# EAGLE design LifeBoardV1.2 (EAGLE 9.6.2)
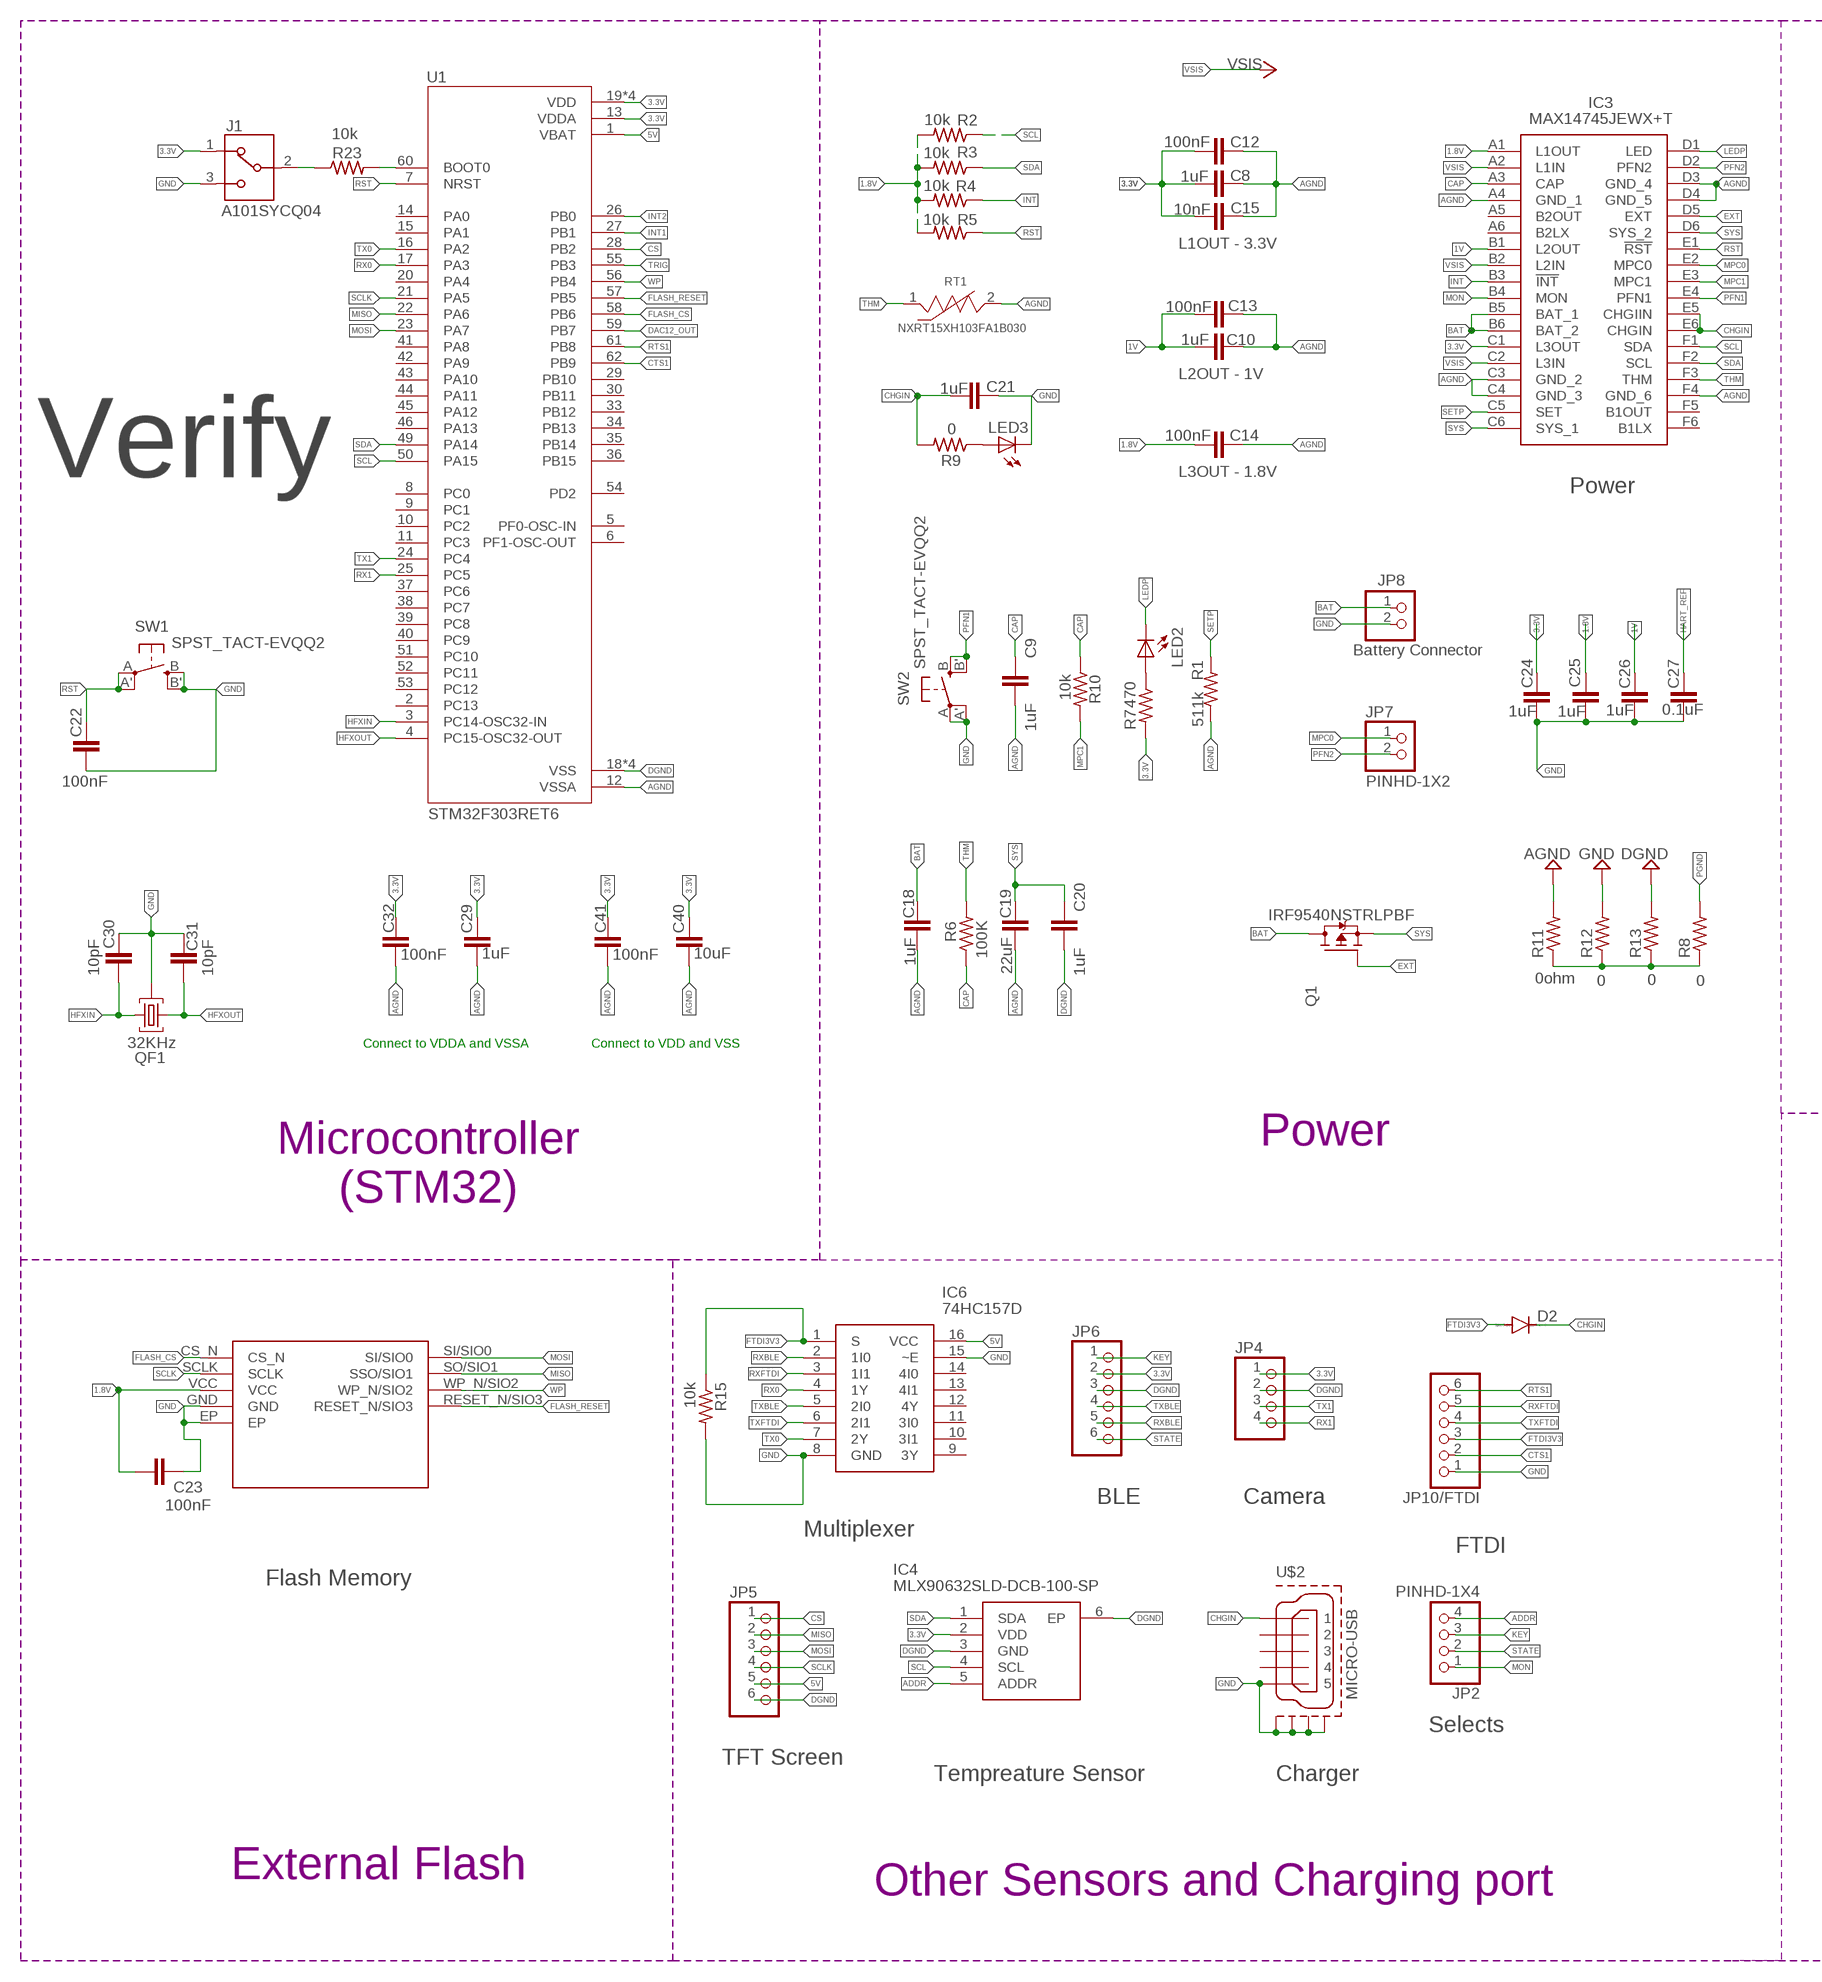
[diagram p0: schematic, sheet 1, part 1 of 2]
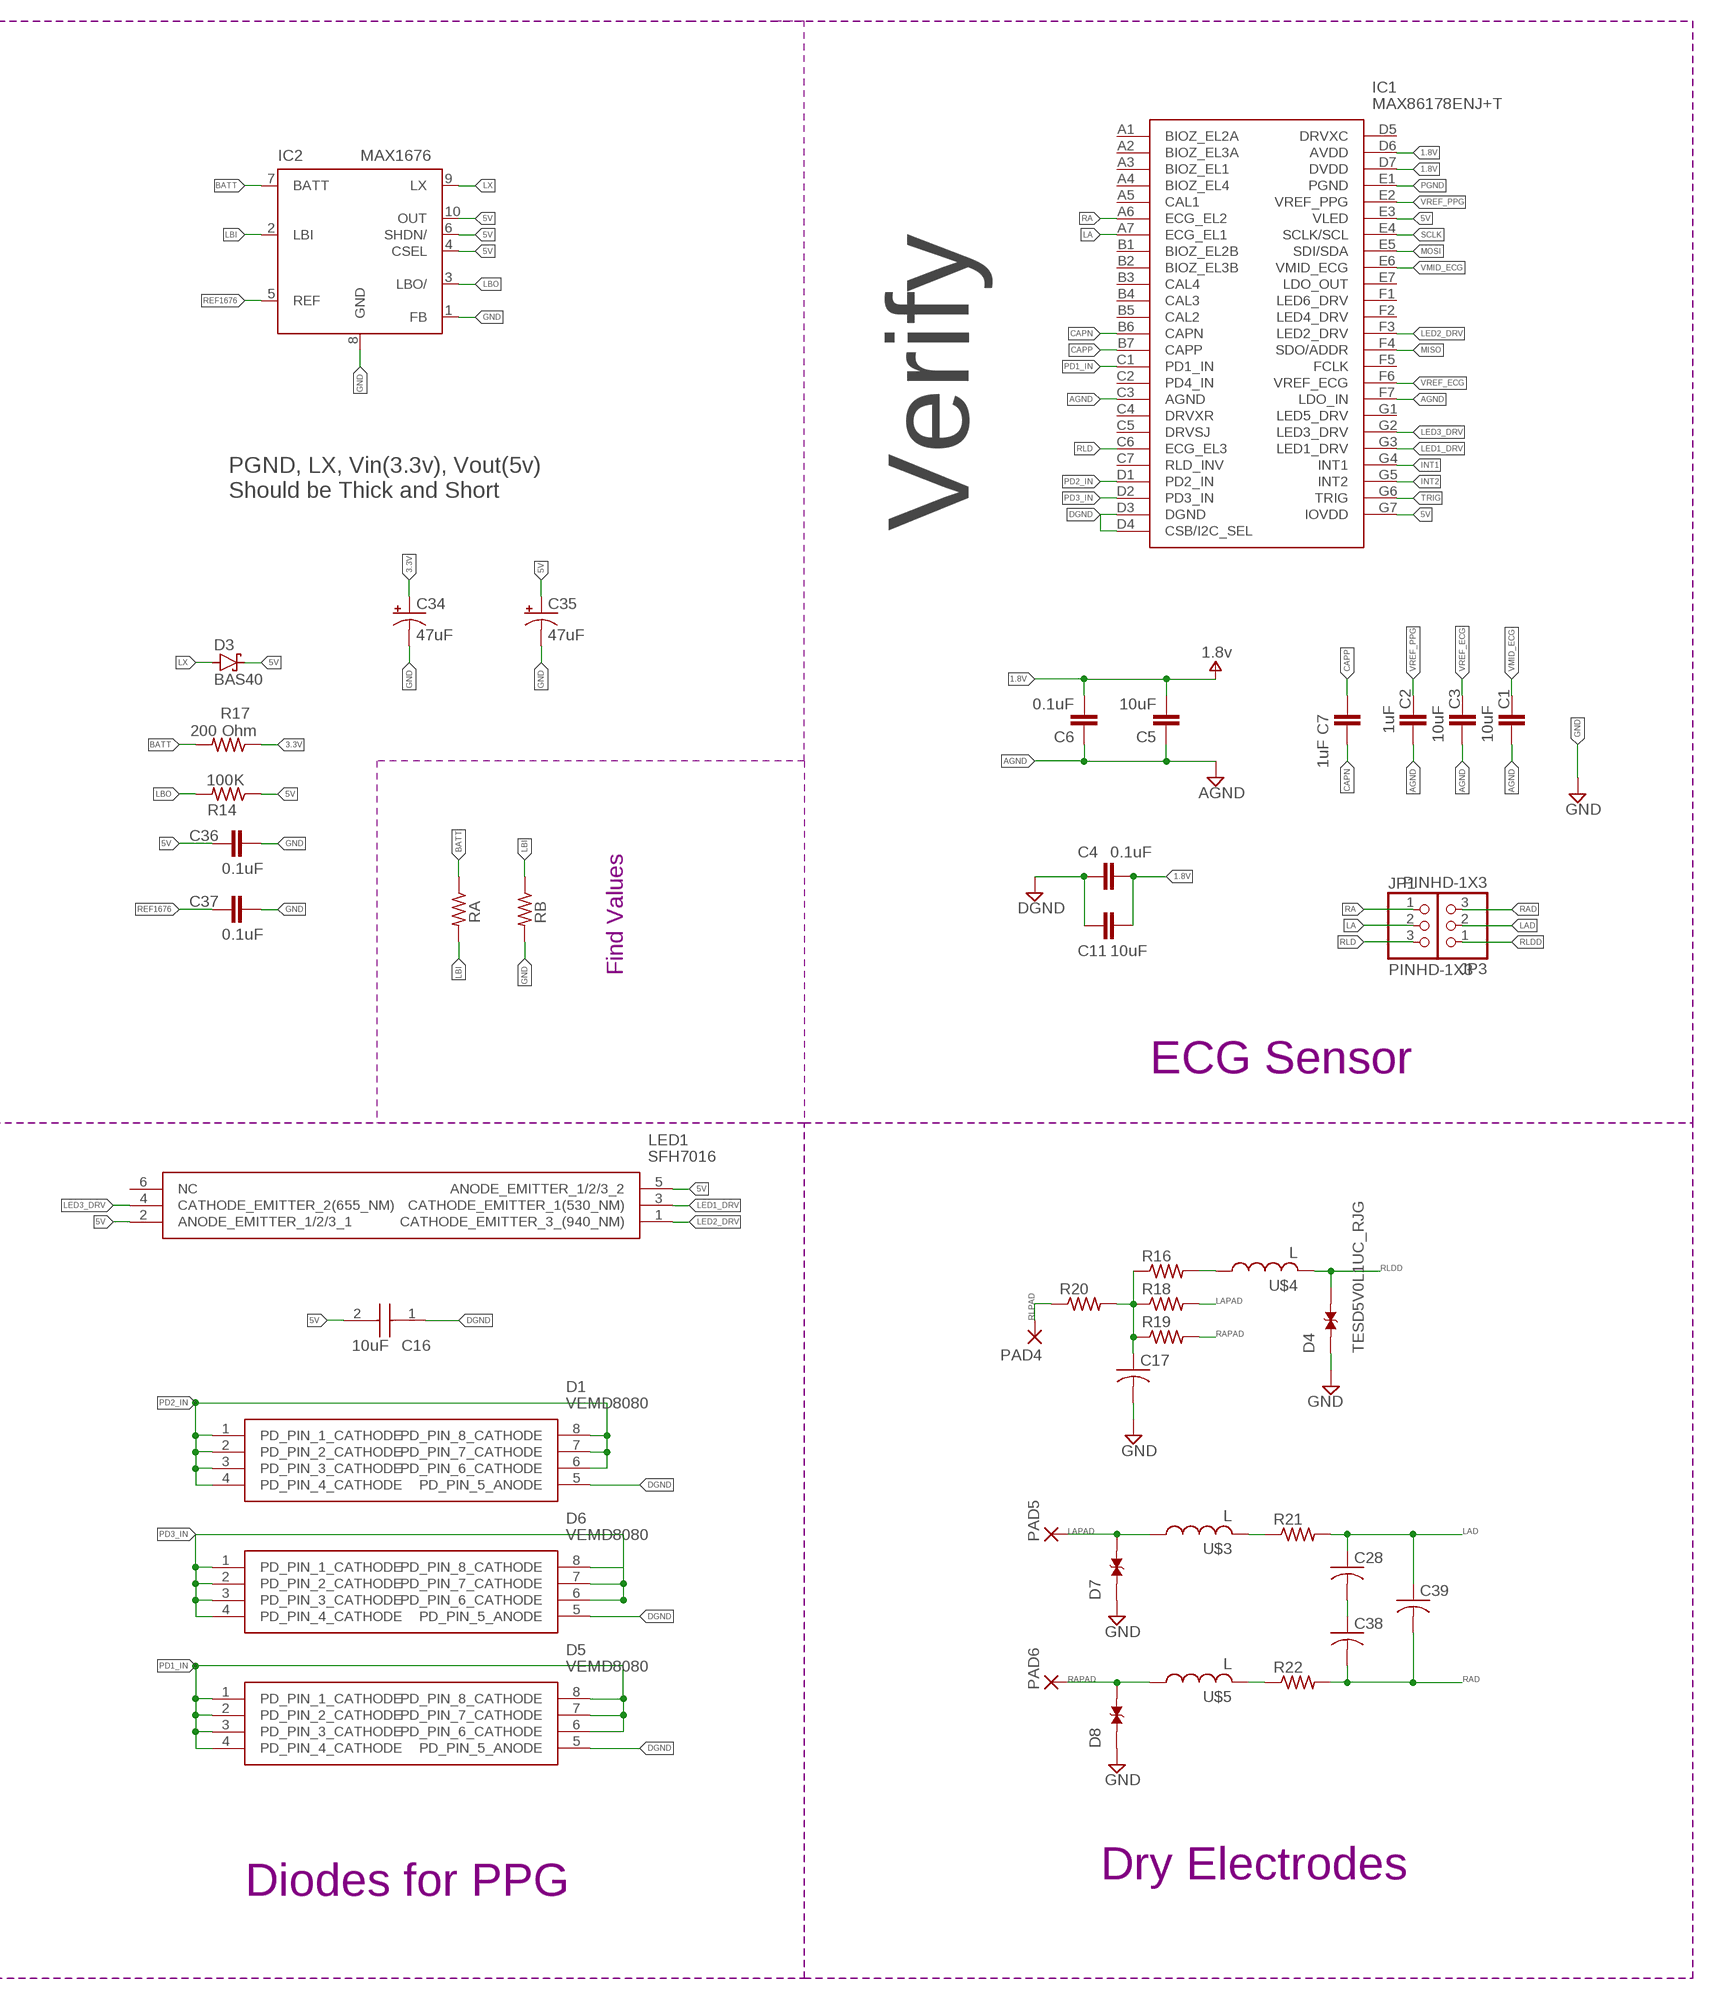
[diagram p1: schematic, sheet 1, part 2 of 2]

## Parts
C1  10uF  C-EUC0805  [C0805]
C2  1uF  C-EUC0805  [C0805]
C3  10uF  C-EUC0805  [C0805]
C4  0.1uF  C-EUC0805  [C0805]
C5  10uF  C-EUC0805  [C0805]
C6  0.1uF  C-EUC0805  [C0805]
C7  1uF  C-EUC0805  [C0805]
C8  1uF  C-EUC0805  [C0805]
C9  1uF  C-EUC0805  [C0805]
C10  1uF  C-EUC0805  [C0805]
C11  10uF  C-EUC0805  [C0805]
C12  100nF  C-EUC0805  [C0805]
C13  100nF  C-EUC0805  [C0805]
C14  100nF  C-EUC0805  [C0805]
C15  10nF  C-EUC0805  [C0805]
C16  10uF  GRM188R61E106MA73L  [CAPC1608X90N]
C17  C-US025-024X044  [C025-024X044]
C18  1uF  C-EUC0805  [C0805]
C19  22uF  C-EUC0805  [C0805]
C20  1uF  C-EUC0805  [C0805]
C21  1uF  C-EUC0805  [C0805]
C22  100nF  C-EUC0805  [C0805]
C23  100nF  C-EUC0805  [C0805]
C24  1uF  C-EUC0805  [C0805]
C25  1uF  C-EUC0805  [C0805]
C26  1uF  C-EUC0805  [C0805]
C27  0.1uF  C-EUC0805  [C0805]
C28  C-US025-024X044  [C025-024X044]
C29  1uF  C-EUC0805  [C0805]
C30  10pF  C-EUC0805  [C0805]
C31  10pF  C-EUC0805  [C0805]
C32  100nF  C-EUC0805  [C0805]
C34  47uF  CPOL-US153CLV-0405  [153CLV-0405]
C35  47uF  CPOL-US153CLV-0405  [153CLV-0405]
C36  0.1uF  C-EUC0805  [C0805]
C37  0.1uF  C-EUC0805  [C0805]
C38  C-US025-024X044  [C025-024X044]
C39  C-US025-024X044  [C025-024X044]
C40  10uF  C-EUC0805  [C0805]
C41  100nF  C-EUC0805  [C0805]
D1  VEMD8080  [VEMD8080]
D2  CGRM4001-G  [SOD-123_MINI-SMA]
D3  BAS40  [SOT23]
D4  TESD5V0L1UC_RJG  [DIO_TESD5V0L1UC_RJG]
D5  VEMD8080  [VEMD8080]
D6  VEMD8080  [VEMD8080]
D7  TESD5V0L1UC_RJG  [DIO_TESD5V0L1UC_RJG]
D8  TESD5V0L1UC_RJG  [DIO_TESD5V0L1UC_RJG]
IC1  MAX86178ENJ+T  [BGA49C35P7X7_277X257X50]
IC2  MAX1676  [UMAX10]
IC3  MAX14745JEWX+T  [BGA36C40P6X6_269X244X69]
IC4  MLX90632SLD-DCB-100-SP  [MLX90632SLDDCB100SP]
IC6  74HC157D  [SOIC127P600X175-16N]
J1  A101SYCQ04  [TE_A101SYCQ04]
JP1  PINHD-1X3  [1X03]
JP2  PINHD-1X4  [1X04]
JP3  PINHD-1X3  [1X03]
JP4  PINHD-1X4  [1X04]
JP5  PINHD-1X6  [1X06]
JP6  PINHD-1X6  [1X06]
JP7  PINHD-1X2  [1X02]
JP8  Battery Connector  PINHD-1X2  [1X02]
JP10/FTDI  PINHD-1X6  [1X06]
LED1  SFH7016  [SFH7016]
LED2  LEDCHIPLED_1206  [CHIPLED_1206]
LED3  LEDCHIPLED_1206  [CHIPLED_1206]
PAD4  SMD5  [SMD2,54-5,08]
PAD5  SMD5  [SMD2,54-5,08]
PAD6  SMD5  [SMD2,54-5,08]
Q1  IRF9540NSTRLPBF  [DPAK254P1524X483-4_3N]
QF1  32KHz  8M10AHC49T  [HC49U]
R1  511k  R-US_M1206  [M1206]
R2  10k  R-US_M1206  [M1206]
R3  10k  R-US_M1206  [M1206]
R4  10k  R-US_M1206  [M1206]
R5  10k  R-US_M1206  [M1206]
R6  100K  R-US_M1206  [M1206]
R7  470  R-US_M1206  [M1206]
R8  0  R-US_R1206  [R1206]
R9  0  R-US_R1206  [R1206]
R10  10k  R-US_M1206  [M1206]
R11  0ohm  R-US_R1206  [R1206]
R12  0  R-US_R1206  [R1206]
R13  0  R-US_R1206  [R1206]
R14  100K  R-US_R1206  [R1206]
R15  10k  R-US_M1206  [M1206]
R16  R-US_0207/10  [0207/10]
R17  200 Ohm  R-US_R1206  [R1206]
R18  R-US_0207/10  [0207/10]
R19  R-US_0207/10  [0207/10]
R20  R-US_0207/10  [0207/10]
R21  R-US_0207/10  [0207/10]
R22  R-US_0207/10  [0207/10]
R23  10k  R-US_M1206  [M1206]
RA  R-US_R1206  [R1206]
RB  R-US_R1206  [R1206]
RT1  NXRT15XH103FA1B030  [THERM_NXRT15XH103FA1B030]
SW1  SPST_TACT-EVQQ2  [EVQ-Q2]
SW2  SPST_TACT-EVQQ2  [EVQ-Q2]
U1  STM32F303RET6  [QFP50P1200X1200X160-64N]
U$1  FLASH  [SON127P600X800X80-9N]
U$2  MICRO-USB  MICRO-USB-RECEPTACLE47589-0001  [47589-0001]
U$3  L  [6000]
U$4  L  [6000]
U$5  L  [6000]

## Nets
1.8V: C4.2 C5.2 C6.2 C11.2 C14.2 C23.1 C25.1 IC1.D6(AVDD) IC1.D7(DVDD) IC3.A1(L1OUT) R2.2 R3.2 R4.2 R5.2 U$1.VCC ; supply symbol labelled 1.8v
1V: C10.2 C13.2 C26.1 IC3.B1(L2OUT)
3.3V: C8.2 C12.2 C15.2 C24.1 C29.1 C32.1 C34.+ C40.1 C41.1 IC3.C1(L3OUT) IC4.2(VDD) J1.1 JP4.1 JP6.2 R7.2 R17.1 U1.13(VDDA) U1.19(VDD) U1.32(VDD) U1.48(VDD) U1.64(VDD)
5V: C16.2 C35.+ C36.1 D3.3(C) IC1.E3(VLED) IC1.G7(IOVDD) IC2.4(CSEL) IC2.6(SHDN/) IC2.10(OUT) IC6.16(VCC) JP5.5 LED1.2(ANODE_EMITTER_1/2/3_1) LED1.5(ANODE_EMITTER_1/2/3_2) R14.1 U1.1(VBAT)
ADDR: IC4.5(ADDR) JP2.4
AGND: C1.1 C2.1 C3.1 C5.1 C6.1 C8.1 C9.2 C10.1 C12.1 C13.1 C14.1 C15.1 C18.2 C19.2 C29.2 C32.2 C40.2 C41.2 IC1.C3(AGND) IC1.F7(LDO_IN) IC3.A4(GND_1) IC3.C3(GND_2) IC3.C4(GND_3) IC3.D3(GND_4) IC3.D4(GND_5) IC3.F4(GND_6) R1.1 R11.2 RT1.2 U1.12(VSSA)
BAT: C18.1 IC3.B5(BAT_1) IC3.B6(BAT_2) JP8.1 Q1.4(D)
BATT: IC2.7(BATT) R17.2 RA.1
CAP: C9.1 IC3.A3(CAP) R6.1 R10.1
CAPN: C7.2 IC1.B6(CAPN)
CAPP: C7.1 IC1.B7(CAPP)
CHGIN: C21.2 D2.C IC3.E5(CHGIIN) IC3.E6(CHGIN) R9.2 U$2.1
CS: JP5.1 U1.28(PB2)
CTS1: JP10/FTDI.2 U1.62(PB9)
DAC12_OUT: U1.59(PB7)
DGND: C4.1 C11.1 C16.1 C20.2 D1.5(PD_PIN_5_ANODE) D5.5(PD_PIN_5_ANODE) D6.5(PD_PIN_5_ANODE) IC1.D3(DGND) IC1.D4(CSB/I2C_SEL) IC4.3(GND) IC4.6(EP) JP4.2 JP5.6 JP6.3 R13.2 U1.18(VSS) U1.31(VSS) U1.47(VSS) U1.63(VSS)
EXT: IC3.D5(EXT) Q1.1(G)
FLASH_CS: U1.58(PB6) U$1.CS_N
FLASH_RESET: U1.57(PB5) U$1.RESET_N/SIO3
FTDI3V3: D2.A IC6.1(S) JP10/FTDI.3 R15.1
GND: C17.2 C21.1 C22.2 C23.2 C24.2 C25.2 C26.2 C27.2 C30.1 C31.1 C34.- C35.- C36.2 C37.2 D4.1 D7.1 D8.1 IC2.1(FB) IC2.8(GND) IC6.8(GND) IC6.15(~E) J1.3 JP8.2 JP10/FTDI.1 LED3.C QF1.2 R12.2 R15.2 RB.2 SW1.B'(S1) SW1.B(S) SW2.A'(P1) SW2.A(P) U$1.EP U$1.GND U$2.5 U$2.CASING1(GND1) U$2.CASING2(GND2) U$2.CASING3(GND3) U$2.CASING4(GND4)
HART_REF: C27.1
HFXIN: C30.2 QF1.3 U1.3(PC14-OSC32-IN)
HFXOUT: C31.2 QF1.1 U1.4(PC15-OSC32-OUT)
INT: IC3.B3(!INT) R4.1
INT1: IC1.G4(INT1) U1.27(PB1)
INT2: IC1.G5(INT2) U1.26(PB0)
KEY: JP2.3 JP6.1
LA: IC1.A7(ECG_EL1) JP1.2
LAD: C28.1 C39.1 JP3.2 R21.2
LAPAD: D7.2 PAD5.1(P) R18.2 U$3.1
LBI: IC2.2(LBI) RA.2 RB.1
LBO: IC2.3(LBO/) R14.2
LED1_DRV: IC1.G3(LED1_DRV) LED1.3(CATHODE_EMITTER_1(530_NM))
LED2_DRV: IC1.F3(LED2_DRV) LED1.1(CATHODE_EMITTER_3_(940_NM))
LED3_DRV: IC1.G2(LED3_DRV) LED1.4(CATHODE_EMITTER_2(655_NM))
LEDP: IC3.D1(LED) LED2.C
LX: D3.1(A) IC2.9(LX)
MISO: IC1.F4(SDO/ADDR) JP5.2 U1.22(PA6) U$1.SO/SIO1(SSO/SIO1)
MON: IC3.B4(MON) JP2.1
MOSI: IC1.E5(SDI/SDA) JP5.3 U1.23(PA7) U$1.SI/SIO0
MPC0: IC3.E2(MPC0) JP7.1
MPC1: IC3.E3(MPC1) R10.2
N$1: LED2.A R7.1
N$2: C17.1 R16.1 R18.1 R19.1 R20.2
N$3: R16.2 U$4.1
N$4: R23.2 U1.60(BOOT0)
N$5: J1.2 R23.1
N$8: R21.1 U$3.2
N$10: C28.2 C38.1
N$12: R22.1 U$5.2
N$28: R8.1 R11.1 R12.1 R13.1
N$29: LED3.A R9.1
PD1_IN: D5.1(PD_PIN_1_CATHODE) D5.2(PD_PIN_2_CATHODE) D5.3(PD_PIN_3_CATHODE) D5.4(PD_PIN_4_CATHODE) D5.6(PD_PIN_6_CATHODE) D5.7(PD_PIN_7_CATHODE) D5.8(PD_PIN_8_CATHODE) IC1.C1(PD1_IN)
PD2_IN: D1.1(PD_PIN_1_CATHODE) D1.2(PD_PIN_2_CATHODE) D1.3(PD_PIN_3_CATHODE) D1.4(PD_PIN_4_CATHODE) D1.6(PD_PIN_6_CATHODE) D1.7(PD_PIN_7_CATHODE) D1.8(PD_PIN_8_CATHODE) IC1.D1(PD2_IN)
PD3_IN: D6.1(PD_PIN_1_CATHODE) D6.2(PD_PIN_2_CATHODE) D6.3(PD_PIN_3_CATHODE) D6.4(PD_PIN_4_CATHODE) D6.6(PD_PIN_6_CATHODE) D6.7(PD_PIN_7_CATHODE) D6.8(PD_PIN_8_CATHODE) IC1.D2(PD3_IN)
PFN1: IC3.E4(PFN1) SW2.B'(S1) SW2.B(S)
PFN2: IC3.D2(PFN2) JP7.2
PGND: IC1.E1(PGND) R8.2
RA: IC1.A6(ECG_EL2) JP1.1
RAD: C38.2 C39.2 JP3.3 R22.2
RAPAD: D8.2 PAD6.1(P) R19.2 U$5.1
REF1676: C37.1 IC2.5(REF)
RLD: IC1.C6(ECG_EL3) JP1.3
RLDD: D4.2 JP3.1 U$4.2
RLPAD: PAD4.1(P) R20.1
RST: C22.1 IC3.E1(!RST) R5.1 SW1.A'(P1) SW1.A(P) U1.7(NRST)
RTS1: JP10/FTDI.6 U1.61(PB8)
RX0: IC6.4(1Y) U1.17(PA3)
RX1: JP4.4 U1.25(PC5)
RXBLE: IC6.2(1I0) JP6.5
RXFTDI: IC6.3(1I1) JP10/FTDI.5
SCL: IC3.F1(SDA) IC4.4(SCL) R2.1 U1.50(PA15)
SCLK: IC1.E4(SCLK/SCL) JP5.4 U1.21(PA5) U$1.SCLK
SDA: IC3.F2(SCL) IC4.1(SDA) R3.1 U1.49(PA14)
SETP: IC3.C5(SET) R1.2
STATE: JP2.2 JP6.6
SYS: C19.1 C20.1 IC3.C6(SYS_1) IC3.D6(SYS_2) Q1.3(S)
THM: IC3.F3(THM) R6.2 RT1.1
TRIG: IC1.G6(TRIG) U1.55(PB3)
TX0: IC6.7(2Y) U1.16(PA2)
TX1: JP4.3 U1.24(PC4)
TXBLE: IC6.5(2I0) JP6.4
TXFTDI: IC6.6(2I1) JP10/FTDI.4
VMID_ECG: C1.2 IC1.E6(VMID_ECG)
VREF_ECG: C3.2 IC1.F6(VREF_ECG)
VREF_PPG: C2.2 IC1.E2(VREF_PPG)
VSIS: IC3.A2(L1IN) IC3.B2(L2IN) IC3.C2(L3IN)
WP: U1.56(PB4) U$1.WP_N/SIO2
Unconnected: IC1.A1(BIOZ_EL2A) IC1.A2(BIOZ_EL3A) IC1.A3(BIOZ_EL1) IC1.A4(BIOZ_EL4) IC1.A5(CAL1) IC1.B1(BIOZ_EL2B) IC1.B2(BIOZ_EL3B) IC1.B3(CAL4) IC1.B4(CAL3) IC1.B5(CAL2) IC1.C2(PD4_IN) IC1.C4(DRVXR) IC1.C5(DRVSJ) IC1.C7(RLD_INV) IC1.D5(DRVXC) IC1.E7(LDO_OUT) IC1.F1(LED6_DRV) IC1.F2(LED4_DRV) IC1.F5(FCLK) IC1.G1(LED5_DRV) IC3.A5(B2OUT) IC3.A6(B2LX) IC3.F5(B1OUT) IC3.F6(B1LX) IC6.9(3Y) IC6.10(3I1) IC6.11(3I0) IC6.12(4Y) IC6.13(4I1) IC6.14(4I0) LED1.6(NC) U1.2(PC13) U1.5(PF0-OSC-IN) U1.6(PF1-OSC-OUT) U1.8(PC0) U1.9(PC1) U1.10(PC2) U1.11(PC3) U1.14(PA0) U1.15(PA1) U1.20(PA4) U1.29(PB10) U1.30(PB11) U1.33(PB12) U1.34(PB13) U1.35(PB14) U1.36(PB15) U1.37(PC6) U1.38(PC7) U1.39(PC8) U1.40(PC9) U1.41(PA8) U1.42(PA9) U1.43(PA10) U1.44(PA11) U1.45(PA12) U1.46(PA13) U1.51(PC10) U1.52(PC11) U1.53(PC12) U1.54(PD2) U$2.2 U$2.3 U$2.4

## Notes on the sheet
- L1OUT - 3.3V
- L2OUT - 1V
- Verify | L3OUT - 1.8V
- Power
- PGND, LX, Vin(3.3v), Vout(5v)
  Should be Thick and Short
- Verify
- Find Values
- Connect to VDDA and VSSA | Connect to VDD and VSS
- ECG Sensor
- Power
- Microcontroller
  (STM32)
- BLE | Camera
- Multiplexer
- FTDI
- Flash Memory
- Selects
- TFT Screen
- Tempreature Sensor | Charger
- External Flash
- Other Sensors and Charging port | Dry Electrodes
- Diodes for PPG

## Library data of the parts
C1-C15 C18-C27 C29-C32 C36 C37 C40 C41 = rcl:C-EU: CAPACITOR, European symbol; SPICEPREFIX: C
C16 = GRM188R61E106MA73L:GRM188R61E106MA73L: Murata 0603 GRM 10uF Ceramic Multilayer Capacitor, 25 V dc, +85C, X5R Dielectric, +/-20% SMD Source: Datasheet <https://datasheet.datasheetarchive.com/originals/distributors/DKDS42/DSANUWW0047682.pdf>; ARROW_PART_NUMBER: GRM188R61E106MA73L; ARROW_PRICE-STOCK: https://www.arrow.com/en/products/grm188r61e106ma73l/murata-manufacturing; DESCRIPTION: Murata 0603 GRM 10uF Ceramic Multilayer Capacitor, 25 V dc, +85C, X5R Dielectric, +/-20% SMD; HEIGHT: 0.9mm; MANUFACTURER_NAME: Murata Electronics; MANUFACTURER_PART_NUMBER: GRM188R61E106MA73L; MOUSER_PART_NUMBER: 81-GRM188R61E106MA3L; MOUSER_PRICE-STOCK: https://www.mouser.co.uk/ProductDetail/Murata-Electronics/GRM188R61E106MA73L?qs=O5cugoO6nwfz85kEL7somA%3D%3D
C17 C28 C38 C39 = adafruit:C-US: CAPACITOR, American symbol
C34 C35 = adafruit:CPOL-US: POLARIZED CAPACITOR, American symbol
D1 D5 D6 = VEMD8080:VEMD8080: Photodiodes Pin Photodiode 20V 350-1100nm; 28uA Source: Datasheet <https://www.vishay.com/docs/84565/vemd8080.pdf>; ARROW_PART_NUMBER: VEMD8080; ARROW_PRICE-STOCK: https://www.arrow.com/en/products/vemd8080/vishay?region=nac; DESCRIPTION: Photodiodes Pin Photodiode 20V 350-1100nm; 28uA; HEIGHT: 0.53mm; MANUFACTURER_NAME: Vishay; MANUFACTURER_PART_NUMBER: VEMD8080; MOUSER_PART_NUMBER: 78-VEMD8080; MOUSER_PRICE-STOCK: https://www.mouser.co.uk/ProductDetail/Vishay-Semiconductors/VEMD8080?qs=F5EMLAvA7IBCchs2bw9l%2Fw%3D%3D
D2 = diode:CGRM400*-G: Molded plasitc,JEDEC SOD-123/Mini SMA Source: Comchip CGRM4001-G.pdf
D3 = diode:BAS40: Silicon Schottky Diodes General-purpose diode for high-speed switching
D4 D7 D8 = TESD5V0L1UC_RJG:TESD5V0L1UC_RJG: Check availability <https://pricing.snapeda.com/parts/TESD5V0L1UC%20RJG/Taiwan%20Semiconductor%20Corporation/view-part?ref=eda>; AVAILABILITY: In Stock; DESCRIPTION: DFN1006L, 5V, 100W, 2pF, ESD Protection Diode & Array; MF: Taiwan Semiconductor Corporation; MP: TESD5V0L1UC RJG; PACKAGE: DFN1006L Taiwan Semiconductor; PRICE: None; PURCHASE-URL: https://pricing.snapeda.com/search/part/TESD5V0L1UC RJG/?ref=eda
IC1 = MAX86178ENJ+T:MAX86178ENJ+T: Ultra-Low-Power, Clinical-Grade Vital-Sign AFE Source: Datasheet <https://g.componentsearchengine.com/Datasheets/0/15123196.pdf>; DESCRIPTION: Ultra-Low-Power, Clinical-Grade Vital-Sign AFE; HEIGHT: 0.5mm; MANUFACTURER_NAME: Maxim Integrated; MANUFACTURER_PART_NUMBER: MAX86178ENJ+T; MOUSER_PART_NUMBER: 700-MAX86178ENJ+T; MOUSER_PRICE-STOCK: https://www.mouser.co.uk/ProductDetail/Maxim-Integrated/MAX86178ENJ%2bT?qs=A6eO%252BMLsxmSS411w8Lj65w%3D%3D
IC2 = MAX1676:MAX1676: DC/DC CONVERTER Check availability <https://pricing.snapeda.com/parts/MAX1676/Maxim%20Integrated/view-part?ref=eda>; AVAILABILITY: In Stock; DESCRIPTION: Boost Switching Regulator IC Positive Adjustable (Programmable) 2V (3.3V, 5V) 1 Output 360mA (Switch), 750mA (Switch) 10-TFSOP, 10-MSOP (0.118, 3.00mm Width); MF: Maxim Integrated; MP: MAX1676; PACKAGE: None; PRICE: None; PURCHASE-URL: https://pricing.snapeda.com/search/part/MAX1676/?ref=eda
IC3 = MAX14745JEWX+T:MAX14745JEWX+T: Battery Management Wearable Charge Management Solution Source: Datasheet <https://pdfserv.maximintegrated.com/en/ds/MAX14745.pdf>; DESCRIPTION: Battery Management Wearable Charge Management Solution; HEIGHT: 0.69mm; MANUFACTURER_NAME: Maxim Integrated; MANUFACTURER_PART_NUMBER: MAX14745JEWX+T; MOUSER_PART_NUMBER: 700-MAX14745JEWX+T; MOUSER_PRICE-STOCK: https://www.mouser.com/Search/Refine.aspx?Keyword=700-MAX14745JEWX%2BT
IC4 = MLX90632SLD-DCB-100-SP:MLX90632SLD-DCB-100-SP: Board Mount Temperature Sensors single pixel, SMD, medical acc., 50deg FoV, 1.8V I2C Source: Datasheet <https://gr.mouser.com/datasheet/2/734/MLX90632_Datasheet_Melexis-1595868.pdf>; DESCRIPTION: Board Mount Temperature Sensors single pixel, SMD, medical acc., 50deg FoV, 1.8V I2C; HEIGHT: 1mm; MANUFACTURER_NAME: Melexis; MANUFACTURER_PART_NUMBER: MLX90632SLD-DCB-100-SP; MOUSER_PART_NUMBER: 482-90632SLDDCB100SP; MOUSER_PRICE-STOCK: https://www.mouser.co.uk/ProductDetail/Melexis/MLX90632SLD-DCB-100-SP?qs=W%2FMpXkg%252BdQ6VXghbjaLHHg%3D%3D
IC6 = 74HC157D:74HC157D: NXP 74HC157D, Encoder Quad 2:1 Multiplexer, 5 V, 16-Pin SOIC Source: Datasheet; DESCRIPTION: NXP 74HC157D, Encoder Quad 2:1 Multiplexer, 5 V, 16-Pin SOIC; HEIGHT: mm; MANUFACTURER_NAME: Nexperia; MANUFACTURER_PART_NUMBER: 74HC157D; MOUSER_PART_NUMBER: 771-74HC157D; MOUSER_PRICE-STOCK: https://www.mouser.com/Search/Refine.aspx?Keyword=771-74HC157D
J1 = A101SYCQ04:A101SYCQ04: Switch Toggle ON None ON SPDT Long Baton Lever PC Pins 5A 250VAC 28VDC PC Mount with Threads Bulk; AVAILABILITY: Unavailable; COMMENT: 4-1825136-5; DESCRIPTION: Toggle Switch SPDT Panel Mount; MF: TE Connectivity; MP: A101SYCQ04; PACKAGE: SOIC-8 TE Connectivity; PRICE: None
JP1 JP3 = Connector:PINHD-1X3: PIN HEADER; CATEGORY: CONNECTOR; SUB-CATEGORY: PIN-HEADER
JP2 = Connector:PINHD-1X4: PIN HEADER; CATEGORY: CONNECTOR; SUB-CATEGORY: PIN-HEADER
JP4 = pinhead:PINHD-1X4: PIN HEADER
JP5 JP6 JP10/FTDI = pinhead:PINHD-1X6: PIN HEADER
JP7 JP8 = Connector:PINHD-1X2: PIN HEADER; CATEGORY: CONNECTOR; SUB-CATEGORY: PIN-HEADER
LED1 = SFH7016:SFH7016: Green (530 nm), Red (655 nm) and Infrared (940 nm) Emitter Source: Datasheet <https://www.osram.com/ecat/Multi CHIPLED SFH 7016/com/en/class_pim_web_catalog_103489/prd_pim_device_6572351/#62a1fdff42f13778e2055fdc87c50fcb>; DESCRIPTION: Green (530 nm), Red (655 nm) and Infrared (940 nm) Emitter; HEIGHT: 0.7mm; MANUFACTURER_NAME: OSRAM; MANUFACTURER_PART_NUMBER: SFH7016
LED2 LED3 = adafruit:LED: LED OSRAM: - CHIPLED LG R971, LG N971, LY N971, LG Q971, LY Q971, LO R971, LY R971 LH N974, LH R974 LS Q976, LO Q976, LY Q976 LO Q996 - Hyper CHIPLED LW Q18S LB Q993, LB Q99A, LB R99A - SideLED LS A670, LO A670, LY A670, LG A670, LP A670 LB A673, LV A673, LT A673, LW A673 LH A674 LY A675 LS A676, LA A676, LO A676, LY A676, LW A676 LS A679, LY A679, LG A679 - Hyper Micro SIDELED® LS Y876, LA Y876, LO Y876, LY Y876 LT Y87S - SmartLED LW L88C, LW L88S LB L89C, LB L89S, LG L890 LS L89K, LO L89K, LY L89K LS L896, LA L896, LO L896, LY L896 - TOPLED LS T670, LO T670, LY T670, LG T670, LP T670 LSG T670, LSP T670, LSY T670, LOP T670, LYG T670 LG T671, LOG T671, LSG T671 LB T673, LV T673, LT T673, LW T673 LH T674 LS T676, LA T676, LO T676, LY T676, LB T676, LH T676, LSB T676, LW T676 LB T67C, LV T67C, LT T67C, LS T67K, LO T67K, LY T67K, LW E67C LS E67B, LA E67B, LO E67B, LY E67B, LB E67C, LV E67C, LT E67C LW T67C LS T679, LY T679, LG T679 LS T770, LO T770, LY T770, LG T770, LP T770 LB T773, LV T773, LT T773, LW T773 LH T774 LS E675, LA E675, LY E675, LS T675 LS T776, LA T776, LO T776, LY T776, LB T776 LHGB T686 LT T68C, LB T68C - Hyper Mini TOPLED® LB M676 - Mini TOPLED Santana® LG M470 LS M47K, LO M47K, LY M47K Source: http://www.osram.convergy.de/
PAD4-PAD6 = wirepad:SMD5: SMD PAD
Q1 = IRF9540NSTRLPBF:IRF9540NSTRLPBF: Single P-Channel 100 V 3.8 W 97 nC Hexfet Power Mosfet Surface Mount - D2PAK-3 Check prices <https://pricing.snapeda.com/search/part/IRF9540NSTRLPBF/?ref=eda>; AVAILABILITY: Good; DESCRIPTION: RoHS Compliant | Low RDS(on) | Industry-leading quality | Dynamic dv/dt Rating | Fast Switching | Fully Avalanche Rated | 175C Operating Temperature | P-Channel MOSFET; MF: Infineon; MP: IRF9540NSTRLPBF; PACKAGE: D2PAK Infineon; PRICE: None; PURCHASE-URL: https://pricing.snapeda.com/search/part/IRF9540NSTRLPBF/?ref=eda
QF1 = crystal:8M10AHC49T: Monolithic Crystal Filters Source: www.vanlong.com; OC_FARNELL: unknown; OC_NEWARK: unknown
R1-R23 RA RB = adafruit:R-US_: RESISTOR, American symbol
RT1 = NXRT15XH103FA1B030:NXRT15XH103FA1B030: THERMISTOR NTC 33KOHM 4050K BEAD Check availability <https://pricing.snapeda.com/parts/NXRT15XH103FA1B030/Murata/view-part?ref=eda>; AVAILABILITY: In Stock; DESCRIPTION: THERMISTOR NTC 10KOHM 3380K BEAD; MF: Murata; MP: NXRT15XH103FA1B030; PACKAGE: RADIAL-2 Murata; PRICE: None; PURCHASE-URL: https://pricing.snapeda.com/search/part/NXRT15XH103FA1B030/?ref=eda
SW1 SW2 = adafruit:SPST_TACT: SMT 6mm switch, EVQQ2 series http://www.ladyada.net/library/eagle
U1 = STM32F303RET6:STM32F303RET6: MCU 32-Bit STM32 ARM Cortex M4 RISC 512KB Flash 2.5V/3.3V 64-Pin LQFP Tray Check availability <https://pricing.snapeda.com/parts/STM32F303RET6/STMicroelectronics/view-part?ref=eda>; AVAILABILITY: In Stock; DESCRIPTION: ARM® Cortex®-M4 STM32F3 Microcontroller IC 32-Bit Single-Core 72MHz 512KB (512K x 8) FLASH 64-LQFP (10x10); MF: STMicroelectronics; MP: STM32F303RET6; PACKAGE: LQFP-64 STMicroelectronics; PRICE: None; PURCHASE-URL: https://pricing.snapeda.com/search/part/STM32F303RET6/?ref=eda
U$1 = SON127P600X800X80-9N:FLASH
U$2 = con-molex-usb:MICRO-USB-RECEPTACLE: MICRO USB RECEPTACLES Micro-USB Receptacles, SMT, Lead-Free from MOLEX <http://www.molex.com/>. (C) 2014 Tomasz Boleslaw CEDRO, cederom@tlen.pl, http://www.tomek.cedro.info. Version 0.1 (2014-01-17): Initial release. Version 0.2 (2014-02-06): Updated 47589-0001 footprint pins/pads/milling. Following devices are included: 1. 47589-0001 Micro-USB AB Receptacle, Bottom Mount, SMT, Lead-Free <http://www.molex.com/molex/products/datasheet.jsp?part=active/0475890001_IO_CONNECTORS.xml> (Technical Drawing <http://www.molex.com/pdm_docs/sd/475890001_sd.pdf>).
U$3-U$5 = adafruit:L

## Board
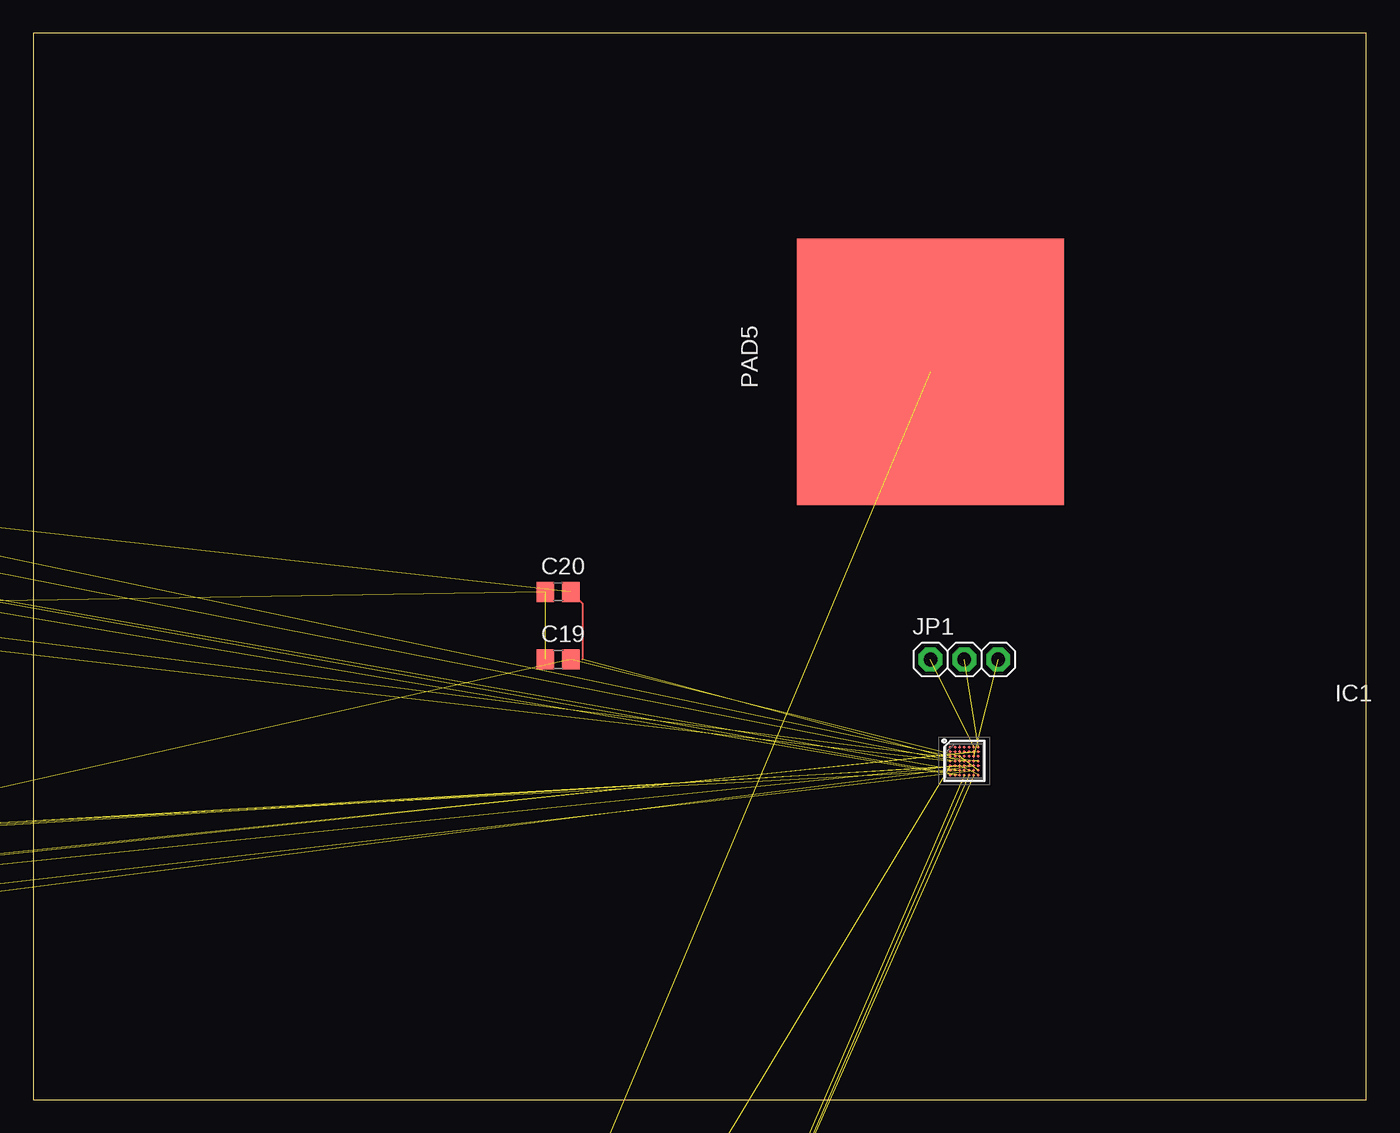
[diagram p2: board, top side]

Size 100 x 80 mm. Coordinates in mm from the lower left corner, seen from the top.
Outline: 0,0 100,0 100,80 0,80 0,0
Copper layers (1*16): Top 0.035mm / dielectric 1.5mm / Bottom 0.035mm
Design rules "default": minimum track width 6mil, minimum drill 0.35mm, track to track 6mil, track to pad 6mil, pad to pad 6mil, via to via 6mil, smd to smd 6mil, copper to edge 40mil, drill to drill 6mil, minimum pad ring 10mil, minimum via ring 8mil, stop-mask expansion 4mil, vias tented up to drill 0mil, thermal gap 10mil

### Footprints (pad centres in the part's own frame; a part is rotated, then mirrored left to right if it is on the bottom)
C0805 = smd 1.3 x 1.5: 1 -0.95,0; 2 0.95,0
CAPC1608X90N = smd 0.75 x 0.94: 1 -0.7,0; 2 0.7,0
C025-024X044 = drill 0.813 pad 1.422 octagon: 1 -1.27,0; 2 1.27,0
153CLV-0405 = smd 2.6 x 1.6: + 1.8,0; - -1.8,0
VEMD8080 = smd 0.54 x 0.55: 1 -2,-1.19; 2 -0.69,-1.19; 3 0.69,-1.19; 4 2,-1.19; 5 2,1.19; 6 0.69,1.19; 7 -0.69,1.19; 8 -2,1.19
SOD-123_MINI-SMA = smd 1.5 x 2.1: A 1.8,0; C -1.8,0
SOT23 = smd 1 x 1.4: 1 -0.95,-1.1; 2 0.95,-1.1; 3 0,1.1
DIO_TESD5V0L1UC_RJG = smd 0.41 x 0.56: 1 -0.35,0; 2 0.35,0
BGA49C35P7X7_277X257X50 = smd 0.208 x 0.208: A1 -1.05,1.05; A2 -0.7,1.05; A3 -0.35,1.05; A4 0,1.05; A5 0.35,1.05; A6 0.7,1.05; A7 1.05,1.05; B1 -1.05,0.7; B2 -0.7,0.7; B3 -0.35,0.7; B4 0,0.7; B5 0.35,0.7; B6 0.7,0.7; B7 1.05,0.7; C1 -1.05,0.35; C2 -0.7,0.35; C3 -0.35,0.35; C4 0,0.35; C5 0.35,0.35; C6 0.7,0.35; C7 1.05,0.35; D1 -1.05,0; D2 -0.7,0; D3 -0.35,0; D4 0,0; D5 0.35,0; D6 0.7,0; D7 1.05,0; E1 -1.05,-0.35; E2 -0.7,-0.35; E3 -0.35,-0.35; E4 0,-0.35; E5 0.35,-0.35; E6 0.7,-0.35; E7 1.05,-0.35; F1 -1.05,-0.7; F2 -0.7,-0.7; F3 -0.35,-0.7; F4 0,-0.7; F5 0.35,-0.7; F6 0.7,-0.7; F7 1.05,-0.7; G1 -1.05,-1.05; G2 -0.7,-1.05; G3 -0.35,-1.05; G4 0,-1.05; G5 0.35,-1.05; G6 0.7,-1.05; G7 1.05,-1.05
UMAX10 = smd 0.32 x 0.9: 1 -1,-2.25; 2 -0.5,-2.25; 3 0,-2.25; 4 0.5,-2.25; 5 1,-2.25; 6 1,2.25; 7 0.5,2.25; 8 0,2.25; 9 -0.5,2.25; 10 -1,2.25
BGA36C40P6X6_269X244X69 = smd 0.216 x 0.216: A1 -1,1; A2 -0.6,1; A3 -0.2,1; A4 0.2,1; A5 0.6,1; A6 1,1; B1 -1,0.6; B2 -0.6,0.6; B3 -0.2,0.6; B4 0.2,0.6; B5 0.6,0.6; B6 1,0.6; C1 -1,0.2; C2 -0.6,0.2; C3 -0.2,0.2; C4 0.2,0.2; C5 0.6,0.2; C6 1,0.2; D1 -1,-0.2; D2 -0.6,-0.2; D3 -0.2,-0.2; D4 0.2,-0.2; D5 0.6,-0.2; D6 1,-0.2; E1 -1,-0.6; E2 -0.6,-0.6; E3 -0.2,-0.6; E4 0.2,-0.6; E5 0.6,-0.6; E6 1,-0.6; F1 -1,-1; F2 -0.6,-1; F3 -0.2,-1; F4 0.2,-1; F5 0.6,-1; F6 1,-1
MLX90632SLDDCB100SP = smd 0.3 x 0.3: 1 -1,-1.15 | smd 0.3 x 0.8: 2 -0.5,-1.15; 3 0,-1.15; 4 0.5,-1.15; 5 1,-1.15 | smd 2.5 x 2.1: 6 0,0.5
SOIC127P600X175-16N = smd 1.702 x 0.533: 1 -2.591,4.445; 2 -2.591,3.175; 3 -2.591,1.905; 4 -2.591,0.635; 5 -2.591,-0.635; 6 -2.591,-1.905; 7 -2.591,-3.175; 8 -2.591,-4.445; 9 2.591,-4.445; 10 2.591,-3.175; 11 2.591,-1.905; 12 2.591,-0.635; 13 2.591,0.635; 14 2.591,1.905; 15 2.591,3.175; 16 2.591,4.445
TE_A101SYCQ04 = drill 1.854 square: 1 -4.699,0 | drill 1.854: 2 0,0; 3 4.699,0
1X03 = drill 1.016 pad 1.778 octagon: 1 -2.54,0; 2 0,0; 3 2.54,0
1X04 = drill 1.016 pad 1.778 octagon: 1 -3.81,0; 2 -1.27,0; 3 1.27,0; 4 3.81,0
1X04' = drill 1.016 long: 1 -3.81,0; 2 -1.27,0; 3 1.27,0; 4 3.81,0
1X06 = drill 1.016 long: 1 -6.35,0; 2 -3.81,0; 3 -1.27,0; 4 1.27,0; 5 3.81,0; 6 6.35,0
1X02 = drill 0.762 pad 1.778: 1 -1.27,0; 2 1.27,0
SFH7016 = smd 0.4 x 0.4: 1 0.65,0.575; 2 0.65,-0.575; 3 0,0.575; 4 0,-0.575; 5 -0.65,0.575; 6 -0.65,-0.575
CHIPLED_1206 = smd 1.5 x 1.5: A 0,-1.75; C 0,1.75
SMD2,54-5,08 = smd 20 x 20: 1 0,0
DPAK254P1524X483-4_3N = smd 3.78 x 1.06: 1 -6.4,2.54; 3 -6.4,-2.54 | smd 7.88 x 6.39: 4 4.35,0
HC49U = drill 0.7 pad 1.2: 1 -2.413,0; 2 -0.027,0; 3 2.413,0
M1206 = smd 1.6 x 2: 1 -1.4,0; 2 1.4,0
R1206 = smd 1.6 x 1.803: 1 -1.422,0; 2 1.422,0
0207/10 = drill 0.813 pad 1.676 octagon: 1 -5.08,0; 2 5.08,0
THERM_NXRT15XH103FA1B030 = drill 0.65 pad 1.05: 1 -1.25,0; 2 1.25,0
EVQ-Q2 = smd 3.2 x 1.2: A -3.4,-2; A' 3.4,-2; B -3.4,2; B' 3.4,2
QFP50P1200X1200X160-64N = smd 1.47 x 0.28: 1 -5.67,3.75; 2 -5.67,3.25; 3 -5.67,2.75; 4 -5.67,2.25; 5 -5.67,1.75; 6 -5.67,1.25; 7 -5.67,0.75; 8 -5.67,0.25; 9 -5.67,-0.25; 10 -5.67,-0.75; 11 -5.67,-1.25; 12 -5.67,-1.75; 13 -5.67,-2.25; 14 -5.67,-2.75; 15 -5.67,-3.25; 16 -5.67,-3.75; 33 5.67,-3.75; 34 5.67,-3.25; 35 5.67,-2.75; 36 5.67,-2.25; 37 5.67,-1.75; 38 5.67,-1.25; 39 5.67,-0.75; 40 5.67,-0.25; 41 5.67,0.25; 42 5.67,0.75; 43 5.67,1.25; 44 5.67,1.75; 45 5.67,2.25; 46 5.67,2.75; 47 5.67,3.25; 48 5.67,3.75 | smd 0.28 x 1.47: 17 -3.75,-5.67; 18 -3.25,-5.67; 19 -2.75,-5.67; 20 -2.25,-5.67; 21 -1.75,-5.67; 22 -1.25,-5.67; 23 -0.75,-5.67; 24 -0.25,-5.67; 25 0.25,-5.67; 26 0.75,-5.67; 27 1.25,-5.67; 28 1.75,-5.67; 29 2.25,-5.67; 30 2.75,-5.67; 31 3.25,-5.67; 32 3.75,-5.67; 49 3.75,5.67; 50 3.25,5.67; 51 2.75,5.67; 52 2.25,5.67; 53 1.75,5.67; 54 1.25,5.67; 55 0.75,5.67; 56 0.25,5.67; 57 -0.25,5.67; 58 -0.75,5.67; 59 -1.25,5.67; 60 -1.75,5.67; 61 -2.25,5.67; 62 -2.75,5.67; 63 -3.25,5.67; 64 -3.75,5.67
SON127P600X800X80-9N = smd 0.94 x 0.44: CS_N -3.885,1.905; GND -3.885,-1.905; RESET_N/SIO3 3.885,0.635; SCLK 3.885,-0.635; SI/SIO0 3.885,-1.905; SO/SIO1 -3.885,0.635; VCC 3.885,1.905; WP_N/SIO2 -3.885,-0.635 | smd 3.4 x 4.3: EP 0,0
47589-0001 = smd 1.35 x 0.4: 1 2.8,1.3; 2 2.8,0.65; 3 2.8,0; 4 2.8,-0.65; 5 2.8,-1.3 | drill 0.8 pad 1.27: CASING1 0,4.327; CASING2 0,-4.327; CASING3 3,2.53; CASING4 3,-2.53 | smd 1.778 x 5.08: P$2 -1.27,0
6000 = drill 1.2 pad 2.184: 1 -2.5,0; 2 2.5,0

### Placement (x,y rotation side)
C1  -16.51,13.97 0 top  (outside the outline)
C2  -39.37,13.97 0 top  (outside the outline)
C3  -22.86,13.97 0 top  (outside the outline)
C4  -36.83,3.81 0 top  (outside the outline)
C5  -29.21,13.97 0 top  (outside the outline)
C6  -43.18,3.81 0 top  (outside the outline)
C7  -44.45,13.97 0 top  (outside the outline)
C8  -15.24,20.32 0 top  (outside the outline)
C9  -55.88,-77.47 0 top  (outside the outline)
C10  -34.29,13.97 0 top  (outside the outline)
C11  -44.45,-3.81 0 top  (outside the outline)
C12  -44.45,-46.99 0 top  (outside the outline)
C13  -44.45,-53.34 0 top  (outside the outline)
C14  -44.45,-59.69 0 top  (outside the outline)
C15  -44.45,-66.04 0 top  (outside the outline)
C16  -33.02,46.99 0 top  (outside the outline)
C17  -194.31,-541.02 0 top  (outside the outline)
C18  -55.88,-119.38 0 top  (outside the outline)
C19  39.37,33.02 0 top
C20  39.37,38.1 0 top
C21  -68.58,-205.74 0 top  (outside the outline)
C22  -194.31,-586.74 0 top  (outside the outline)
C23  -106.68,-250.19 0 top  (outside the outline)
C24  -106.68,-265.43 0 top  (outside the outline)
C25  -106.68,-271.78 0 top  (outside the outline)
C26  -106.68,-278.13 0 top  (outside the outline)
C27  -114.3,-284.48 0 top  (outside the outline)
C28  -189.23,-541.02 0 top  (outside the outline)
C29  -182.88,-593.09 0 top  (outside the outline)
C30  -175.26,-586.74 0 top  (outside the outline)
C31  -168.91,-586.74 0 top  (outside the outline)
C32  -187.96,-586.74 0 top  (outside the outline)
C34  -163.83,-381 0 top  (outside the outline)
C35  -163.83,-398.78 0 top  (outside the outline)
C36  -163.83,-411.48 0 top  (outside the outline)
C37  -163.83,-417.83 0 top  (outside the outline)
C38  -184.15,-541.02 0 top  (outside the outline)
C39  -179.07,-541.02 0 top  (outside the outline)
C40  -194.31,-593.09 0 top  (outside the outline)
C41  -181.61,-586.74 0 top  (outside the outline)
D1  -40.64,36.83 0 top  (outside the outline)
D2  -127,-346.71 0 top  (outside the outline)
D3  -137.16,-377.19 0 top  (outside the outline)
D4  -161.29,-538.48 0 top  (outside the outline)
D5  -17.78,43.18 0 top  (outside the outline)
D6  -27.94,43.18 0 top  (outside the outline)
D7  -154.94,-538.48 0 top  (outside the outline)
D8  -194.31,-543.56 0 top  (outside the outline)
IC1  69.85,25.4 0 top
IC2  -171.45,-438.15 0 top  (outside the outline)
IC3  -26.67,36.83 0 top  (outside the outline)
IC4  -25.4,31.75 0 top  (outside the outline)
IC6  -123.19,-321.31 0 top  (outside the outline)
J1  -172.72,-558.8 0 top  (outside the outline)
JP1  69.85,33.02 0 top
JP2  -168.91,-457.2 0 top  (outside the outline)
JP3  -191.77,-548.64 0 top  (outside the outline)
JP4  [1X04']  -19.05,25.4 0 top  (outside the outline)
JP5  -30.48,19.05 0 top  (outside the outline)
JP6  -39.37,-41.91 0 top  (outside the outline)
JP7  -60.96,-166.37 0 top  (outside the outline)
JP8  -85.09,-224.79 0 top  (outside the outline)
JP10/FTDI  -80.01,-238.76 0 top  (outside the outline)
LED1  -38.1,43.18 0 top  (outside the outline)
LED2  -62.23,-143.51 0 top  (outside the outline)
LED3  -74.93,-212.09 0 top  (outside the outline)
PAD4  -181.61,-491.49 0 top  (outside the outline)
PAD5  67.31,54.61 0 top
PAD6  -181.61,-511.81 0 top  (outside the outline)
Q1  -55.88,-154.94 0 top  (outside the outline)
QF1  -171.45,-577.85 0 top  (outside the outline)
R1  -55.88,-72.39 0 top  (outside the outline)
R2  -55.88,-90.17 0 top  (outside the outline)
R3  -55.88,-95.25 0 top  (outside the outline)
R4  -55.88,-100.33 0 top  (outside the outline)
R5  -55.88,-105.41 0 top  (outside the outline)
R6  -55.88,-125.73 0 top  (outside the outline)
R7  -55.88,-143.51 0 top  (outside the outline)
R8  -68.58,-200.66 0 top  (outside the outline)
R9  -68.58,-212.09 0 top  (outside the outline)
R10  -74.93,-218.44 0 top  (outside the outline)
R11  -68.58,-185.42 0 top  (outside the outline)
R12  -68.58,-190.5 0 top  (outside the outline)
R13  -68.58,-195.58 0 top  (outside the outline)
R14  -163.83,-405.13 0 top  (outside the outline)
R15  -128.27,-340.36 0 top  (outside the outline)
R16  -180.34,-525.78 0 top  (outside the outline)
R17  -171.45,-445.77 0 top  (outside the outline)
R18  -167.64,-525.78 0 top  (outside the outline)
R19  -154.94,-525.78 0 top  (outside the outline)
R20  -190.5,-535.94 0 top  (outside the outline)
R21  -177.8,-535.94 0 top  (outside the outline)
R22  -165.1,-535.94 0 top  (outside the outline)
R23  -187.96,-593.09 0 top  (outside the outline)
RA  -163.83,-430.53 0 top  (outside the outline)
RB  -171.45,-452.12 0 top  (outside the outline)
RT1  -68.58,-166.37 0 top  (outside the outline)
SW1  -191.77,-577.85 0 top  (outside the outline)
SW2  -191.77,-454.66 0 top  (outside the outline)
U1  -187.96,-562.61 0 top  (outside the outline)
U$1  -104.14,-241.3 0 top  (outside the outline)
U$2  -114.3,-275.59 0 top  (outside the outline)
U$3  -166.37,-506.73 0 top  (outside the outline)
U$4  -156.21,-506.73 0 top  (outside the outline)
U$5  -191.77,-527.05 0 top  (outside the outline)

### Tracks (layer width: path | path; a pad name or v marks a point on that pad's centre or on a via)
1.8V  (14 unrouted)
1V  (3 unrouted)
3.3V  (20 unrouted)
5V  (14 unrouted)
ADDR  (1 unrouted)
AGND  (29 unrouted)
BAT  (4 unrouted)
BATT  (2 unrouted)
CAP  (3 unrouted)
CAPN  (1 unrouted)
CAPP  (1 unrouted)
CHGIN  (5 unrouted)
CS  (1 unrouted)
CTS1  (1 unrouted)
DGND  (18 unrouted)
  Top 0.152: C20.2 41.2,37.22 41.2,33.02
EXT  (1 unrouted)
FLASH_CS  (1 unrouted)
FLASH_RESET  (1 unrouted)
FTDI3V3  (3 unrouted)
GND  (39 unrouted)
HFXIN  (2 unrouted)
HFXOUT  (2 unrouted)
INT  (1 unrouted)
INT1  (1 unrouted)
INT2  (1 unrouted)
KEY  (1 unrouted)
LA  (1 unrouted)
LAD  (3 unrouted)
LAPAD  (3 unrouted)
LBI  (2 unrouted)
LBO  (1 unrouted)
LED1_DRV  (1 unrouted)
LED2_DRV  (1 unrouted)
LED3_DRV  (1 unrouted)
LEDP  (1 unrouted)
LX  (1 unrouted)
MISO  (3 unrouted)
MON  (1 unrouted)
MOSI  (3 unrouted)
MPC0  (1 unrouted)
MPC1  (1 unrouted)
N$1  (1 unrouted)
N$2  (4 unrouted)
N$3  (1 unrouted)
N$4  (1 unrouted)
N$5  (1 unrouted)
N$8  (1 unrouted)
N$10  (1 unrouted)
N$12  (1 unrouted)
N$28  (3 unrouted)
N$29  (1 unrouted)
PD1_IN  (7 unrouted)
PD2_IN  (7 unrouted)
PD3_IN  (7 unrouted)
PFN1  (2 unrouted)
PFN2  (1 unrouted)
PGND  (1 unrouted)
RA  (1 unrouted)
RAD  (3 unrouted)
RAPAD  (3 unrouted)
REF1676  (1 unrouted)
RLD  (1 unrouted)
RLDD  (2 unrouted)
RLPAD  (1 unrouted)
RST  (5 unrouted)
RTS1  (1 unrouted)
RX0  (1 unrouted)
RX1  (1 unrouted)
RXBLE  (1 unrouted)
RXFTDI  (1 unrouted)
SCL  (3 unrouted)
SCLK  (3 unrouted)
SDA  (3 unrouted)
SETP  (1 unrouted)
STATE  (1 unrouted)
SYS  (4 unrouted)
THM  (2 unrouted)
TRIG  (1 unrouted)
TX0  (1 unrouted)
TX1  (1 unrouted)
TXBLE  (1 unrouted)
TXFTDI  (1 unrouted)
VMID_ECG  (1 unrouted)
VREF_ECG  (1 unrouted)
VREF_PPG  (1 unrouted)
VSIS  (2 unrouted)
WP  (1 unrouted)